# EAGLE schematic KON-SU260 (EAGLE 6.5.0)
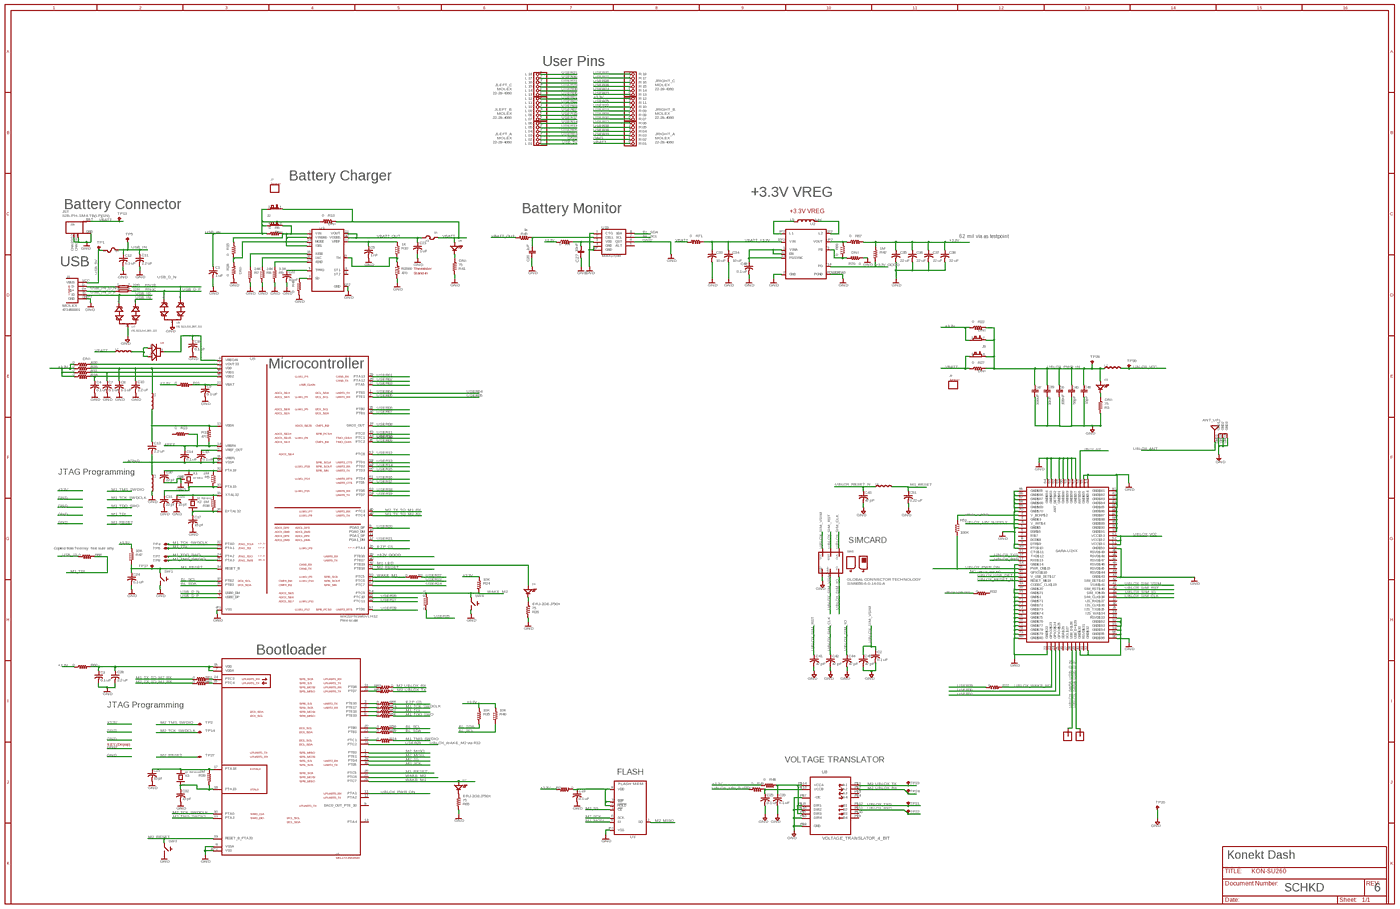
[diagram p0: schematic, sheet 1, overview]
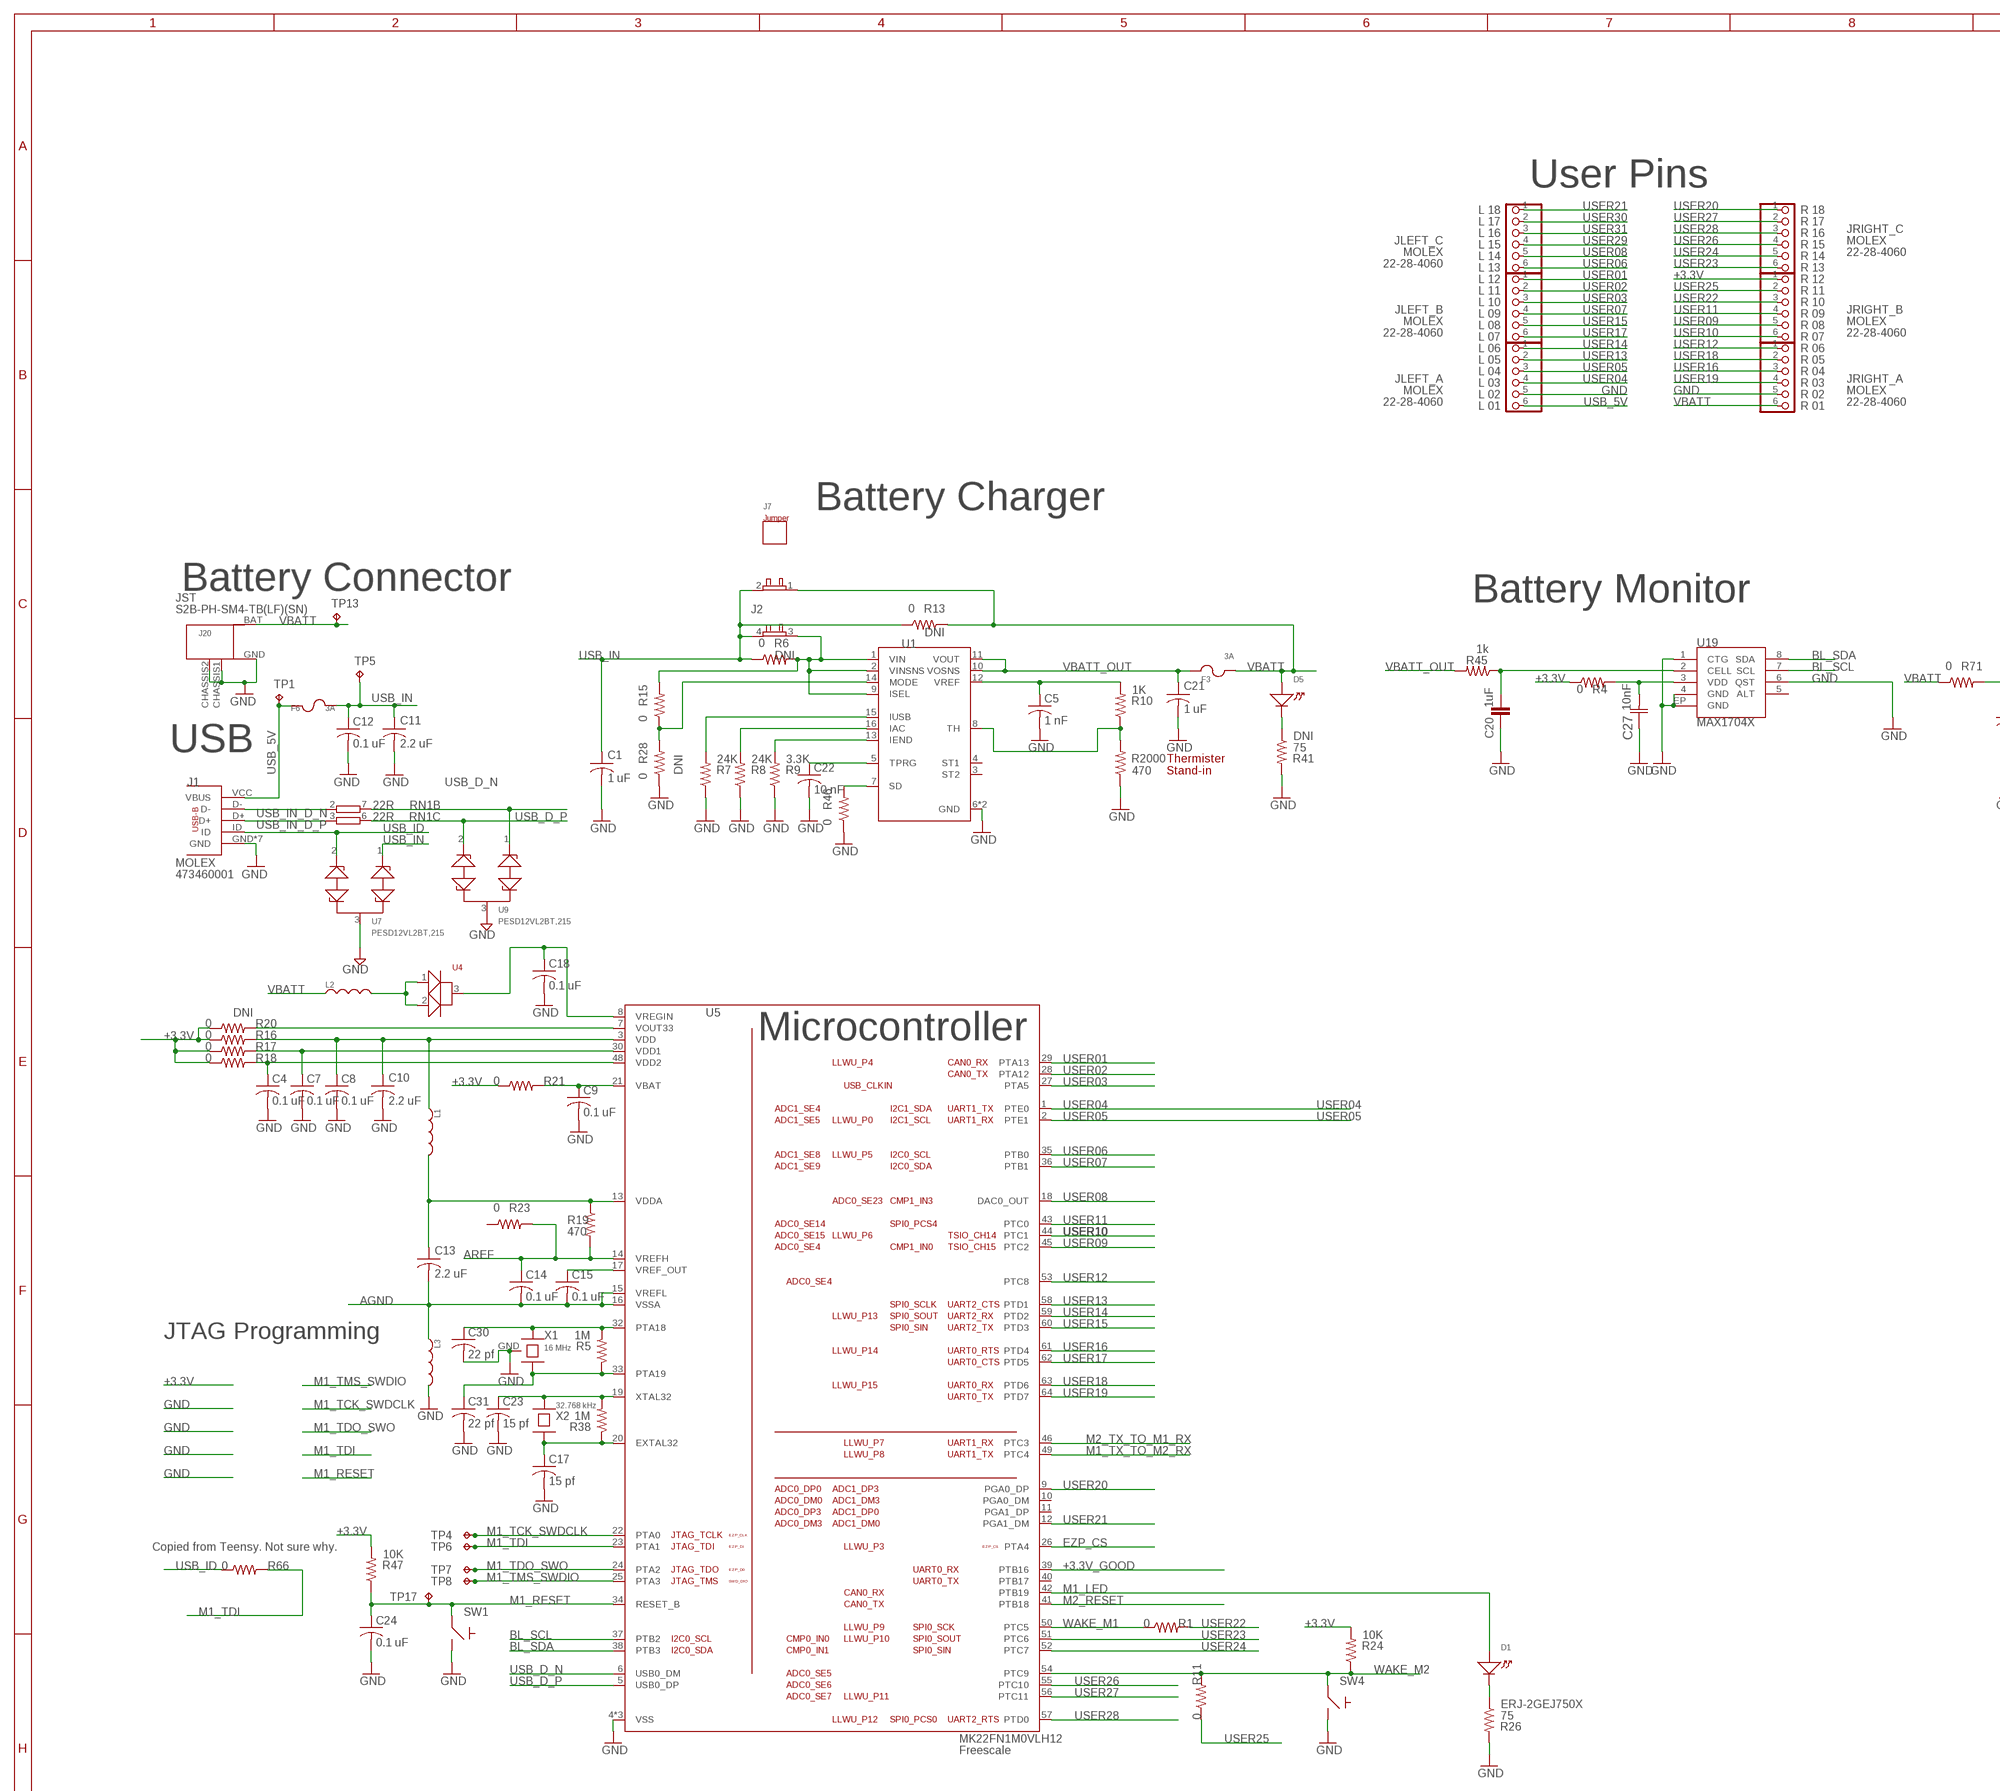
[diagram p1: schematic, sheet 1, part 1 of 4]
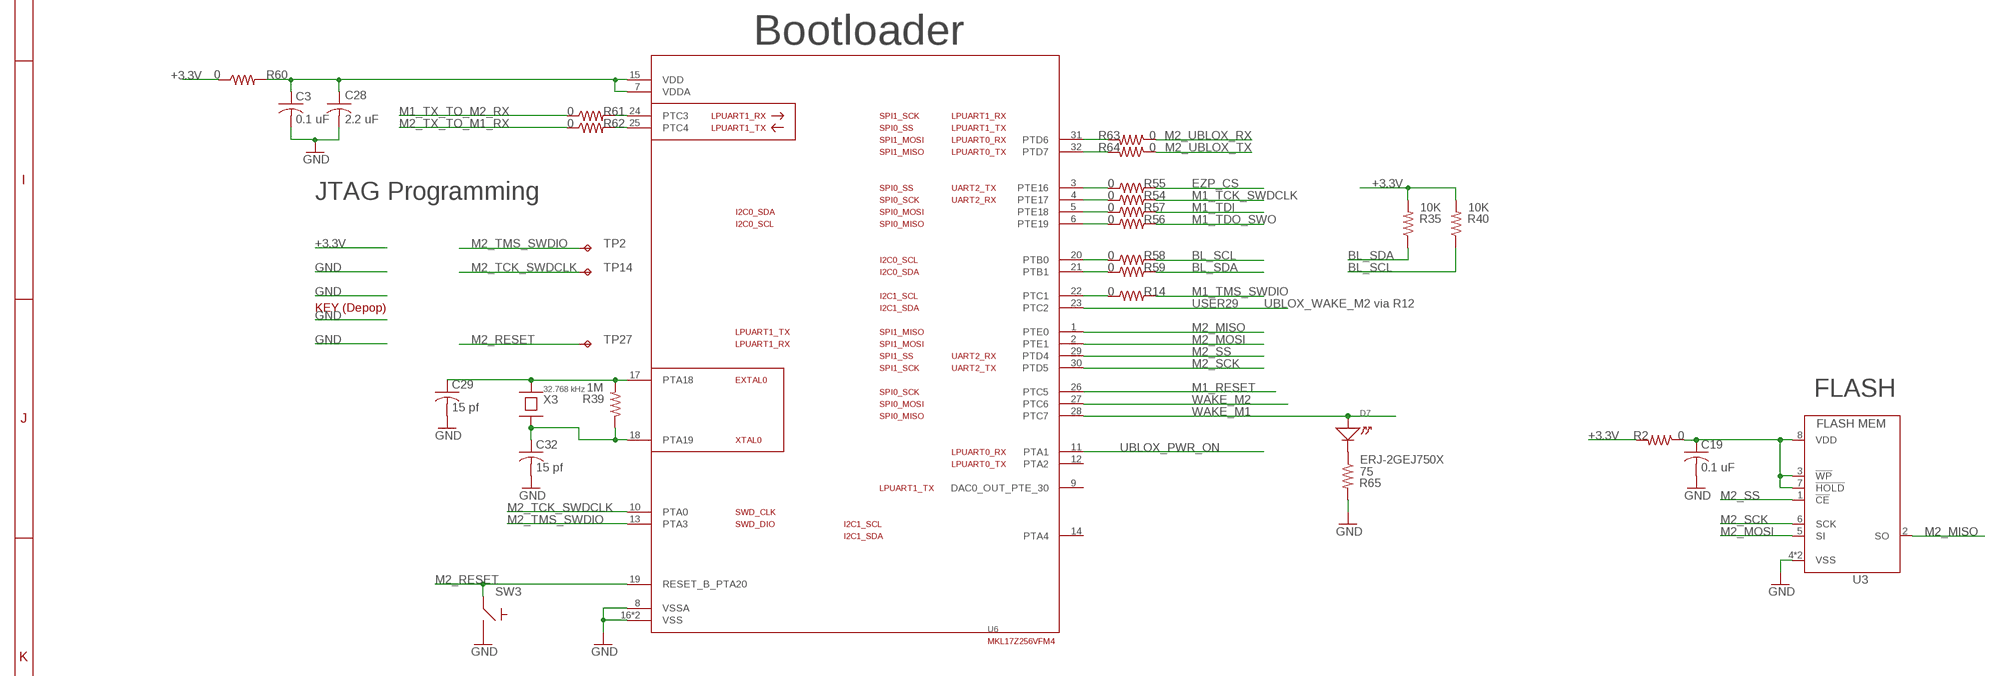
[diagram p2: schematic, sheet 1, part 2 of 4]
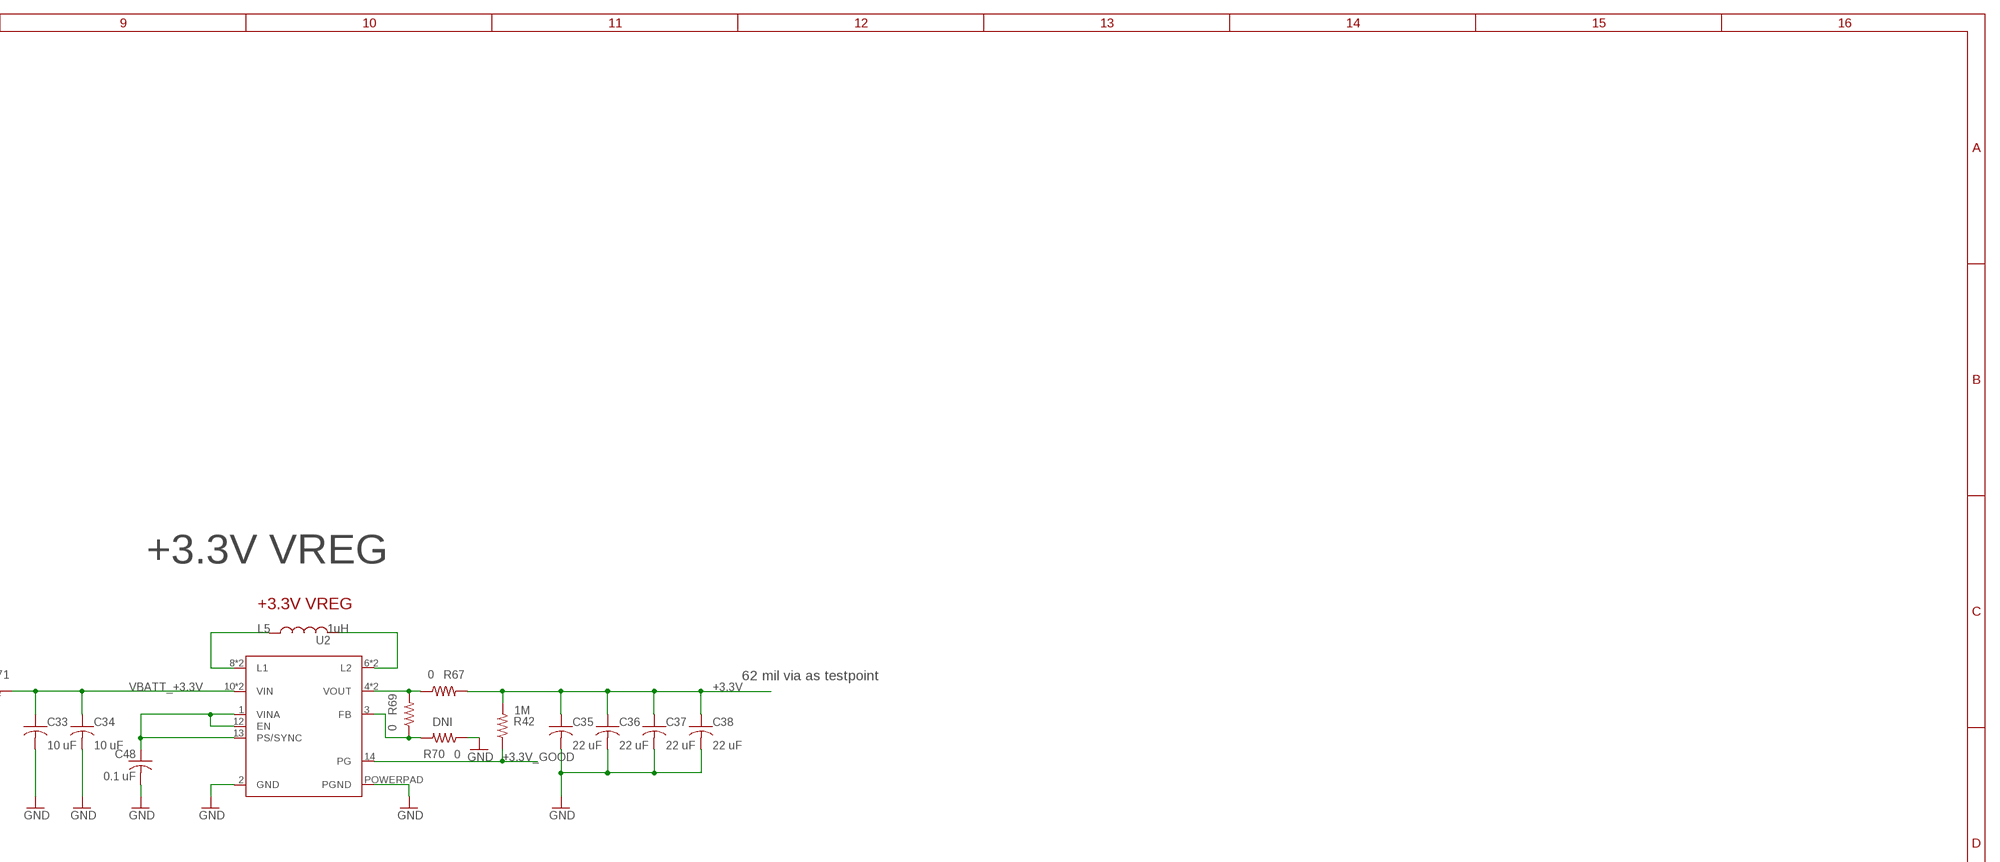
[diagram p3: schematic, sheet 1, part 3 of 4]
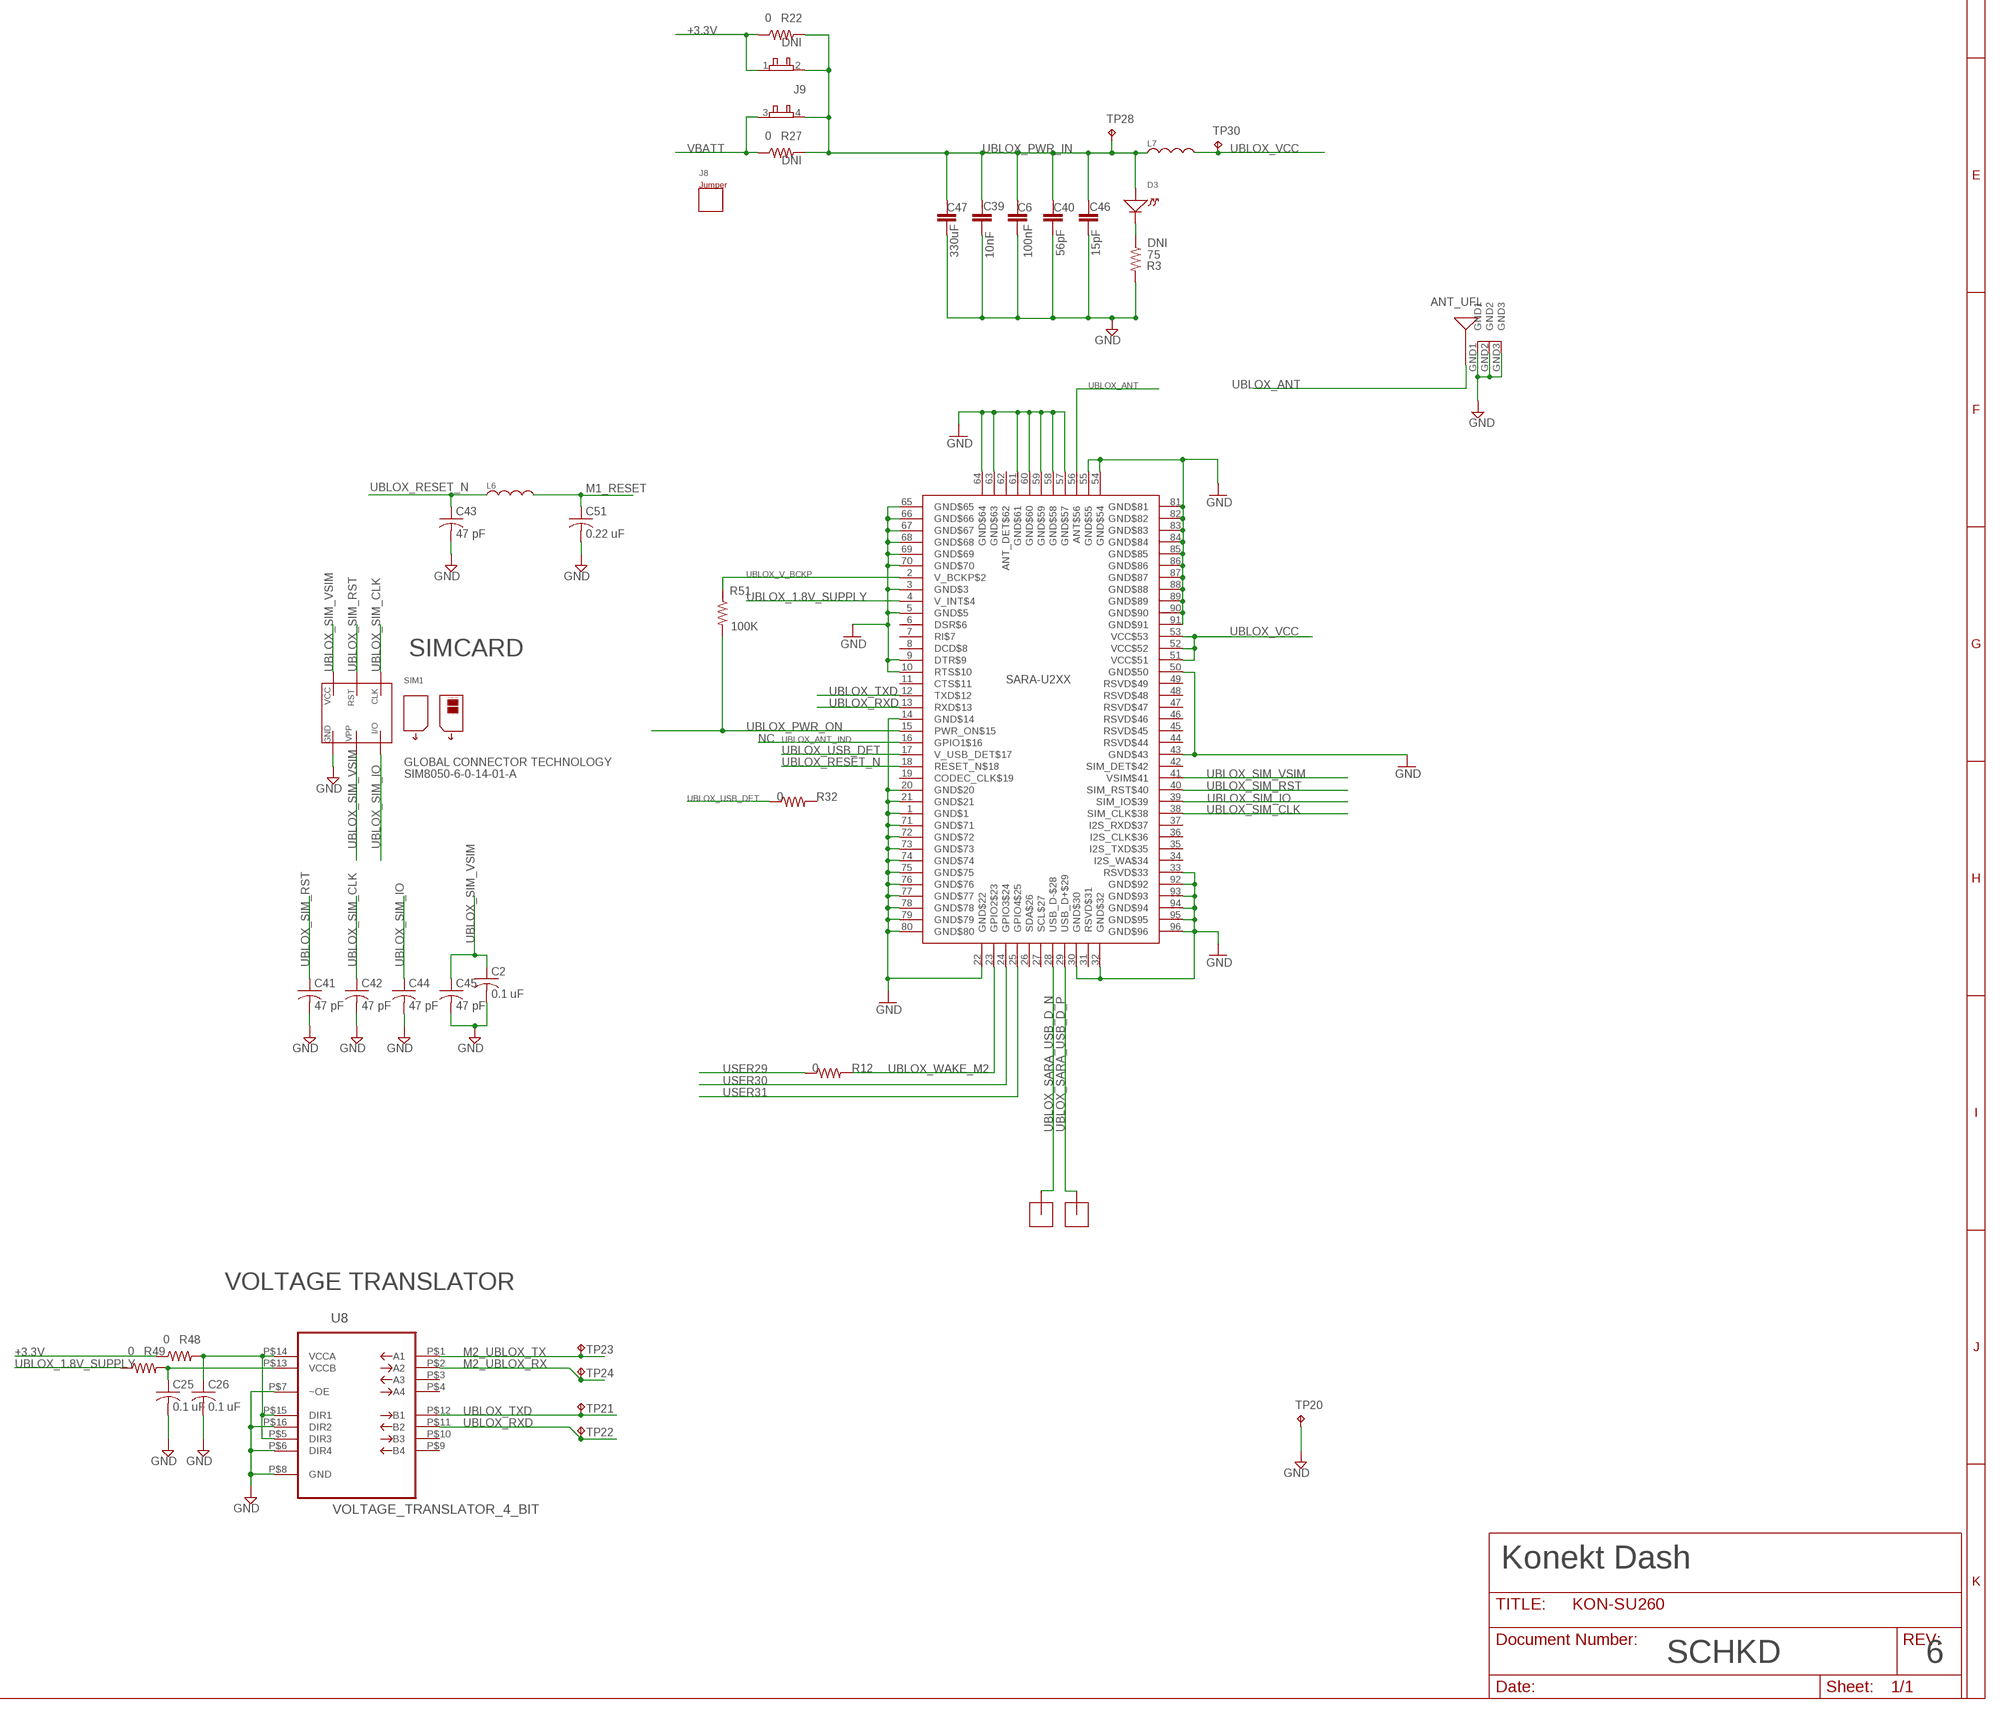
[diagram p4: schematic, sheet 1, part 4 of 4]

## Parts
ANT_UFL  ANT-A-1JB  [UFL]
C1  1 uF  C-USC0603  [C0603]
C2  0.1 uF  C-USC0402  [C0402]
C3  0.1 uF  C-USC0402  [C0402]
C4  0.1 uF  C-USC0402  [C0402]
C5  1 nF  C-USC0402  [C0402]
C6  100nF  CAP0402-CAP  [0402-CAP@1]
C7  0.1 uF  C-USC0402  [C0402]
C8  0.1 uF  C-USC0402  [C0402]
C9  0.1 uF  C-USC0402  [C0402]
C10  2.2 uF  C-USC0603  [C0603]
C11  2.2 uF  C-USC0603  [C0603]
C12  0.1 uF  C-USC0603  [C0603]
C13  2.2 uF  C-USC0603  [C0603]
C14  0.1 uF  C-USC0402  [C0402]
C15  0.1 uF  C-USC0402  [C0402]
C17  15 pf  C-USC0402  [C0402]
C18  0.1 uF  C-USC0402  [C0402]
C19  0.1 uF  C-USC0402  [C0402]
C20  1uF  CAPACITOR0402  [0402-CAP]
C21  1 uF  C-USC0603  [C0603]
C22  10 nF  C-USC0402  [C0402]
C23  15 pf  C-USC0402  [C0402]
C24  0.1 uF  C-USC0402  [C0402]
C25  0.1 uF  C-USC0402  [C0402]
C26  0.1 uF  C-USC0402  [C0402]
C27  10nF  GRM155R71E103KA01D  [CAPC1005X60N]
C28  2.2 uF  C-USC0603  [C0603]
C29  15 pf  C-USC0402  [C0402]
C30  22 pf  C-USC0402  [C0402]
C31  22 pf  C-USC0402  [C0402]
C32  15 pf  C-USC0402  [C0402]
C33  10 uF  C-USC0603  [C0603]
C34  10 uF  C-USC0603  [C0603]
C35  22 uF  C-USC0603  [C0603]
C36  22 uF  C-USC0603  [C0603]
C37  22 uF  C-USC0603  [C0603]
C38  22 uF  C-USC0603  [C0603]
C39  10nF  CAP0402-CAP  [0402-CAP@1]
C40  56pF  CAP0402-CAP  [0402-CAP@1]
C41  47 pF  C-USC0402  [C0402]
C42  47 pF  C-USC0402  [C0402]
C43  47 pF  C-USC0402  [C0402]
C44  47 pF  C-USC0402  [C0402]
C45  47 pF  C-USC0402  [C0402]
C46  15pF  CAP0402-CAP  [0402-CAP@1]
C47  330uF  CAP1210-CAP  [1210-CAP]
C48  0.1 uF  C-USC0402  [C0402]
C51  0.22 uF  C-USC0402  [C0402]
D1  LED_0402_VLMW  [LED_0402_VISHAY_VLMW]
D3  LED_0402_VLMW  [LED_0402_VISHAY_VLMW]
D5  LED_0402_VLMW  [LED_0402_VISHAY_VLMW]
D7  LED_0402_VLMW  [LED_0402_VISHAY_VLMW]
F3  3A  FUSE_0603  [R0603]
F6  3A  FUSE_0603  [R0603]
J1  USB_MICRO_B_MOLEX_473460001  [USB_MICRO_MOLEX_473460001]
J2  CON_JUMPER_1.27_2X2  [FCI_CON_1.27_2X2]
J7  JUMPER_1.27MM  [NOTHING]
J8  JUMPER_1.27MM  [NOTHING]
J9  CON_JUMPER_1.27_2X2  [FCI_CON_1.27_2X2]
J20  BAT_TERM  [JST-PH-2]
JLEFT_A  PINHD-1X6  [1X06]
JLEFT_B  PINHD-1X6  [1X06]
JLEFT_C  PINHD-1X6  [1X06]
JRIGHT_A  PINHD-1X6  [1X06]
JRIGHT_B  PINHD-1X6  [1X06]
JRIGHT_C  PINHD-1X6  [1X06]
L1  INDUCTOR_0603  [R0603$1]
L2  INDUCTOR_0603  [R0603$1]
L3  INDUCTOR_0603  [R0603$1]
L5  1uH  INDUCTOR_1UH_XFL4020-102MEC  [COILCRAFT_XFL4020]
L6  INDUCTOR_0603  [R0603$1]
L7  INDUCTOR_0603  [R0603$1]
R1  0  RESISTOR0402-RES  [0402-RES]
R2  0  RESISTOR0402-RES  [0402-RES]
R3  75  RESISTOR0402-RES  [0402-RES]
R4  0  RESISTOR0402-RES  [0402-RES]
R5  1M  RESISTOR0402-RES  [0402-RES]
R6  0  RESISTOR0402-RES  [0402-RES]
R7  24K  RESISTOR0402-RES  [0402-RES]
R8  24K  RESISTOR0402-RES  [0402-RES]
R9  3.3K  RESISTOR0402-RES  [0402-RES]
R10  1K  RESISTOR0402-RES  [0402-RES]
R11  0  RESISTOR0402-RES  [0402-RES]
R12  0  RESISTOR0402-RES  [0402-RES]
R13  0  RESISTOR0402-RES  [0402-RES]
R14  0  RESISTOR0402-RES  [0402-RES]
R15  0  RESISTOR0402-RES  [0402-RES]
R16  0  RESISTOR0402-RES  [0402-RES]
R17  0  RESISTOR0402-RES  [0402-RES]
R18  0  RESISTOR0402-RES  [0402-RES]
R19  470  R-US_R0402  [R0402]
R20  0  RESISTOR0402-RES  [0402-RES]
R21  0  RESISTOR0402-RES  [0402-RES]
R22  0  RESISTOR0402-RES  [0402-RES]
R23  0  RESISTOR0402-RES  [0402-RES]
R24  10K  RESISTOR0402-RES  [0402-RES]
R26  75  RESISTOR0402-RES  [0402-RES]
R27  0  RESISTOR0402-RES  [0402-RES]
R28  0  RESISTOR0402-RES  [0402-RES]
R32  0  RESISTOR0402-RES  [0402-RES]
R35  10K  RESISTOR0402-RES  [0402-RES]
R38  1M  RESISTOR0402-RES  [0402-RES]
R39  1M  RESISTOR0402-RES  [0402-RES]
R40  10K  RESISTOR0402-RES  [0402-RES]
R41  75  RESISTOR0402-RES  [0402-RES]
R42  1M  RESISTOR0402-RES  [0402-RES]
R45  1k  RESISTOR  [0402-RES]
R46  0  RESISTOR0402-RES  [0402-RES]
R47  10K  RESISTOR0402-RES  [0402-RES]
R48  0  RESISTOR0402-RES  [0402-RES]
R49  0  RESISTOR0402-RES  [0402-RES]
R51  100K  R-US_R0402  [R0402]
R54  0  RESISTOR0402-RES  [0402-RES]
R55  0  RESISTOR0402-RES  [0402-RES]
R56  0  RESISTOR0402-RES  [0402-RES]
R57  0  RESISTOR0402-RES  [0402-RES]
R58  0  RESISTOR0402-RES  [0402-RES]
R59  0  RESISTOR0402-RES  [0402-RES]
R60  0  RESISTOR0402-RES  [0402-RES]
R61  0  RESISTOR0402-RES  [0402-RES]
R62  0  RESISTOR0402-RES  [0402-RES]
R63  0  RESISTOR0402-RES  [0402-RES]
R64  0  RESISTOR0402-RES  [0402-RES]
R65  75  RESISTOR0402-RES  [0402-RES]
R66  0  RESISTOR0402-RES  [0402-RES]
R67  0  RESISTOR0402-RES  [0402-RES]
R69  0  RESISTOR0402-RES  [0402-RES]
R70  0  RESISTOR0402-RES  [0402-RES]
R71  0  RESISTOR0402-RES  [0402-RES]
R2000  470  RESISTOR0402-RES  [0402-RES]
RN1  22R  4R-NCAY16  [CAY16]
SIM1  SIM_CARD_NANO  [SIM_CARD_NANO]
SW1  SWITCH_PANASONIC_EVP-BB2A1B000  [SWITCH_PANASONIC_EVPBB]
SW3  SWITCH_PANASONIC_EVP-BB2A1B000  [SWITCH_PANASONIC_EVPBB]
SW4  SWITCH_PANASONIC_EVP-BB2A1B000  [SWITCH_PANASONIC_EVPBB]
TP1  TPTP08R  [TP08R]
TP2  TPTP08R  [TP08R]
TP4  TPTP08R  [TP08R]
TP5  TPTP08R  [TP08R]
TP6  TPTP08R  [TP08R]
TP7  TPTP08R  [TP08R]
TP8  TPTP08R  [TP08R]
TP13  TPTP08R  [TP08R]
TP14  TPTP08R  [TP08R]
TP17  TPTP08R  [TP08R]
TP20  TPTP08R  [TP08R]
TP21  TPTP08R  [TP08R]
TP22  TPTP08R  [TP08R]
TP23  TPTP08R  [TP08R]
TP24  TPTP08R  [TP08R]
TP27  TPTP08R  [TP08R]
TP28  TPTP08R  [TP08R]
TP30  TPTP08R  [TP08R]
U1  ST_MICRO_BAT_CHARGER_L6924U013  [BAT_CHARGE_ST_MICRO_L6924U]
U2  TPS63021  [QFN-14-POWERPAD3X4DSJ]
U3  MICROCHIP_FLASH_MEM  [TDFN8_5X6]
U4  DIODE_DUAL_SCHOTKEY  [SOT23-3]
U5  MK20DX128VLH5  [MK20DX128VLH5]
U6  FREESCALE_MKL17Z256VFM4  [QFN_32_5X5]
U7  PESD12VL2BT,215  [SOT23]
U8  VOLTAGE_TRANSLATOR_4_BIT  [UQFN_16]
U9  PESD12VL2BT,215  [SOT23]
U19  MAX1704X  [TDFN-8]
U420  SARA-U2XX  [91-PIN_LGA]
U$1  TESTPAD  [TESTPAD]
U$2  TESTPAD  [TESTPAD]
X1  16 MHz  CERAMIC_RESONATOR_16MHZ_MURATA_CSTCE  [CRYSTAL_RESONATOR_MURATA_CSTCE]
X2  32.768 kHz  CRYSTAL_32.768K_AVX  [CRYSTAL_ST3215SB]
X3  32.768 kHz  CRYSTAL_32.768K_AVX  [CRYSTAL_ST3215SB]

## Nets
+3.3V: C35.1 C36.1 C37.1 C38.1 J9.1 JRIGHT_B.1 R2.2 R4.1 R16.1 R17.1 R18.1 R20.1 R21.1 R22.1 R24.2 R35.2 R40.2 R42.2 R47.2 R48.1 R60.1 R67.2
+3.3V_FLASH: C19.1 R2.1 U3.3(!WP) U3.7(!HOLD) U3.8(VDD)
+3.3V_GOOD: R42.1 U2.14(PG) U5.39(PTB16)
AGND: C13.2 C14.2 C15.2 L3.1 U5.15(VREFL) U5.16(VSSA)
AREF: C14.1 R19.2 R23.2 U5.14(VREFH)
BL_SCL [HIGH_SPEED]: R40.1 R58.2 U5.37(PTB2) U19.7(SCL)
BL_SDA [HIGH_SPEED]: R35.1 R59.2 U5.38(PTB3) U19.8(SDA)
EZP_CS: R55.2 U5.26(PTA4)
GND [gnd]: ANT_UFL.GND1 ANT_UFL.GND2 ANT_UFL.GND3 C1.2 C2.2 C3.2 C4.2 C5.2 C6.1 C7.2 C8.2 C9.2 C10.2 C11.2 C12.2 C17.2 C18.2 C19.2 C20.2 C21.2 C22.2 C23.2 C24.2 C25.2 C26.2 C27.1(C1) C28.2 C29.2 C30.2 C31.2 C32.2 C33.2 C34.2 C35.2 C36.2 C37.2 C38.2 C39.1 C40.1 C41.2 C42.2 C43.2 C44.2 C45.2 C46.1 C47.2 C48.2 C51.2 J1.GND J1.GND$1(GND) J1.GND$2(GND) J1.GND$3(GND) J1.GND$4(GND) J1.GND$5(GND) J1.GND$6(GND) J20.CHASSIS1(CHASSIS_1) J20.CHASSIS2(CHASSIS_2) J20.GND JLEFT_A.5 JRIGHT_A.5 L3.2 R3.2 R7.1 R8.1 R9.1 R26.2 R28.1 R41.2 R46.1 R65.2 R70.1 R2000.1 SIM1.C5(GND) SW1.B SW1.B2 SW3.B SW3.B2 SW4.B SW4.B2 TP20.TP U1.6(GND) U1.PAD(GND) U2.2(GND) U2.POWERPAD(PGND) U3.4(VSS) U3.P$9(VSS) U5.4(VSS) U5.31(VSS) U5.47(VSS) U6.8(VSSA) U6.16(VSS) U6.PAD(VSS) U7.3 U8.P$6(DIR4) U8.P$7(~OE) U8.P$8(GND) U8.P$16(DIR2) U9.3 U19.1(CTG) U19.4(GND) U19.6(QST) U19.EP(GND) U420.1(GND$1) U420.3(GND$3) U420.5(GND$5) U420.9(DTR$9) U420.10(RTS$10) U420.14(GND$14) U420.20(GND$20) U420.21(GND$21) U420.22(GND$22) U420.30(GND$30) U420.32(GND$32) U420.33(RSVD$33) U420.43(GND$43) U420.50(GND$50) U420.54(GND$54) U420.55(GND$55) U420.57(GND$57) U420.58(GND$58) U420.59(GND$59) U420.60(GND$60) U420.61(GND$61) U420.63(GND$63) U420.64(GND$64) U420.65(GND$65) U420.66(GND$66) U420.67(GND$67) U420.68(GND$68) U420.69(GND$69) U420.70(GND$70) U420.71(GND$71) U420.72(GND$72) U420.73(GND$73) U420.74(GND$74) U420.75(GND$75) U420.76(GND$76) U420.77(GND$77) U420.78(GND$78) U420.79(GND$79) U420.80(GND$80) U420.81(GND$81) U420.82(GND$82) U420.83(GND$83) U420.84(GND$84) U420.85(GND$85) U420.86(GND$86) U420.87(GND$87) U420.88(GND$88) U420.89(GND$89) U420.90(GND$90) U420.91(GND$91) U420.92(GND$92) U420.93(GND$93) U420.94(GND$94) U420.95(GND$95) U420.96(GND$96) X1.GND
M1_LED: D1.ANODE U5.42(PTB19)
M1_RESET: C24.1 C51.1 L6.2 R47.1 SW1.A SW1.A2 TP17.TP U5.34(RESET_B) U6.26(PTC5)
M1_TCK_SWDCLK: R54.2 TP4.TP U5.22(PTA0)
M1_TDI: R57.2 R66.2 TP6.TP U5.23(PTA1)
M1_TDO_SWO: R56.2 TP7.TP U5.24(PTA2)
M1_TMS_SWDIO: R14.2 TP8.TP U5.25(PTA3)
M1_TX_TO_M2_RX: R61.1 U5.49(PTC4)
M2_MISO: U3.2(SO) U6.1(PTE0)
M2_MOSI: U3.5(SI) U6.2(PTE1)
M2_RESET: SW3.A SW3.A2 TP27.TP U5.41(PTB18) U6.19(RESET_B_PTA20)
M2_RX: R61.2 U6.24(PTC3)
M2_SCK: U3.6(SCK) U6.30(PTD5)
M2_SPI0_MISO: R56.1 U6.6(PTE19)
M2_SPI0_MOSI: R57.1 U6.5(PTE18)
M2_SS: U3.1(!CE) U6.29(PTD4)
M2_TCK_SWDCLK: TP14.TP U6.10(PTA0)
M2_TMS_SWDIO: TP2.TP U6.13(PTA3)
M2_TX: R62.2 U6.25(PTC4)
M2_TX_TO_M1_RX: R62.1 U5.46(PTC3)
M2_UBLOX_RX: R63.1 TP24.TP U8.P$2(A2)
M2_UBLOX_TX: R64.1 TP23.TP U8.P$1(A1)
N$1: C20.1 R45.1 U19.2(CELL)
N$3: C27.2(C2) R4.2 U19.3(VDD)
N$4: J2.3 R6.2 R15.2 U1.1(VIN) U1.2(VINSNS) U1.9(ISEL)
N$5: R10.1 R2000.2 U1.8(TH)
N$6: C5.1 R10.2 U1.12(VREF)
N$7: D3.CATHODE R3.1
N$8: R7.2 U1.15(IUSB)
N$9: L5.P$1 U2.8(L1) U2.9(L1)
N$10: R8.2 U1.16(IAC)
N$11: C30.1 R5.2 U5.32(PTA18) X1.XTAL1
N$12: R9.2 U1.13(IEND)
N$13: D5.CATHODE R41.1
N$14: C22.1 U1.5(TPRG)
N$17: C8.1 C10.1 L1.1 R16.2 U5.3(VDD)
N$18: C7.1 R17.2 U5.30(VDD1)
N$19: C4.1 R18.2 U5.48(VDD2)
N$20: C18.1 U4.3(C) U5.8(VREGIN)
N$21: R20.2 U5.7(VOUT33)
N$22: C15.1 U5.17(VREF_OUT)
N$23: C13.1 L1.2 R19.1 U5.13(VDDA)
N$25: L2.2 U4.1(A1) U4.2(A2)
N$27: C9.1 R21.2 U5.21(VBAT)
N$28: C31.1 R5.1 U5.33(PTA19) X1.XTAL2
N$29: C23.1 R38.2 U5.19(XTAL32) X2.P$2(XTAL2)
N$30: R58.1 U6.20(PTB0)
N$31: C17.1 R38.1 U5.20(EXTAL32) X2.P$1(XTAL1)
N$32: L5.P$2 U2.6(L2) U2.7(L2)
N$33: D1.CATHODE R26.1
N$35: R14.1 U6.22(PTC1)
N$36: R15.1 R28.2 U1.14(MODE)
N$37: R46.2 U1.7(SD)
N$38: R67.1 R69.2 U2.4(VOUT) U2.5(VOUT)
N$40: R63.2 U6.31(PTD6)
N$41: R64.2 U6.32(PTD7)
N$42: R55.1 U6.3(PTE16)
N$43: R54.1 U6.4(PTE17)
N$48: R59.1 U6.21(PTB1)
N$51: C3.1 C28.1 R60.2 U6.7(VDDA) U6.15(VDD)
N$56: D7.CATHODE R65.1
N$57: C32.1 R39.1 U6.18(PTA19) X3.P$1(XTAL1)
N$58: C29.1 R39.2 U6.17(PTA18) X3.P$2(XTAL2)
N$59: C48.1 U2.1(VINA) U2.12(EN) U2.13(PS/SYNC)
N$61: R69.1 R70.2 U2.3(FB)
UBLOX_1.8V_SUPPLY: R49.1 U420.4(V_INT$4)
UBLOX_ANT [HIGH_SPEED]: ANT_UFL.SIGNAL U420.56(ANT$56)
UBLOX_ANT_IND: U420.16(GPIO1$16)
UBLOX_PWR_IN: C6.2 C39.2 C40.2 C46.2 C47.1 D3.ANODE J9.2 J9.4 L7.1 R22.2 R27.2 TP28.TP
UBLOX_PWR_ON: R51.2 U6.11(PTA1) U420.15(PWR_ON$15)
UBLOX_RESET_N: C43.1 L6.1 U420.18(RESET_N$18)
UBLOX_RXD [HIGH_SPEED]: TP22.TP U8.P$11(B2) U420.13(RXD$13)
UBLOX_SARA_USB_D_N [DIFF_HIGH_SPEED]: U420.28(USB_D-$28) U$2.P$1
UBLOX_SARA_USB_D_P [DIFF_HIGH_SPEED]: U420.29(USB_D+$29) U$1.P$1
UBLOX_SIM_CLK [HIGH_SPEED]: C42.1 SIM1.C3(CLK) U420.38(SIM_CLK$38)
UBLOX_SIM_IO [HIGH_SPEED]: C44.1 SIM1.C7(IO) U420.39(SIM_IO$39)
UBLOX_SIM_RST [HIGH_SPEED]: C41.1 SIM1.C2(RST) U420.40(SIM_RST$40)
UBLOX_SIM_VSIM [HIGH_SPEED]: C2.1 C45.1 SIM1.C1(VCC) SIM1.C6(VCC2) U420.41(VSIM$41)
UBLOX_TXD [HIGH_SPEED]: TP21.TP U8.P$12(B1) U420.12(TXD$12)
UBLOX_USB_DET [Vbatt]: R32.1 U420.17(V_USB_DET$17)
UBLOX_V_BCKP: R51.1 U420.2(V_BCKP$2)
UBLOX_VCC: L7.2 TP30.TP U420.51(VCC$51) U420.52(VCC$52) U420.53(VCC$53)
UBLOX_WAKE_M2: R12.2 U420.23(GPIO2$23)
USB_5V: F6.1 J1.VCC(VBUS) JLEFT_A.6 TP1.TP
USB_D_N [DIFF_HIGH_SPEED]: RN1.7 U5.6(USB0_DM) U9.1
USB_D_P [DIFF_HIGH_SPEED]: RN1.6 U5.5(USB0_DP) U9.2
USB_ID: J1.ID R66.1 U7.2
USB_IN [Vbatt]: C1.1 C11.1 C12.1 F6.2 J2.2 J2.4 R6.1 R13.1 TP5.TP U7.1
USB_IN_D_N [DIFF_HIGH_SPEED]: J1.D- RN1.2
USB_IN_D_P [DIFF_HIGH_SPEED]: J1.D+ RN1.3
USER01 [HIGH_SPEED]: JLEFT_B.1 U5.29(PTA13)
USER02 [HIGH_SPEED]: JLEFT_B.2 U5.28(PTA12)
USER03 [HIGH_SPEED]: JLEFT_B.3 U5.27(PTA5)
USER04 [HIGH_SPEED]: JLEFT_A.4 U5.1(PTE0)
USER05 [HIGH_SPEED]: JLEFT_A.3 U5.2(PTE1)
USER06 [HIGH_SPEED]: JLEFT_C.6 U5.35(PTB0)
USER07 [HIGH_SPEED]: JLEFT_B.4 U5.36(PTB1)
USER08 [HIGH_SPEED]: JLEFT_C.5 U5.18(DAC0_OUT)
USER09 [HIGH_SPEED]: JRIGHT_B.5 U5.45(PTC2)
USER10 [HIGH_SPEED]: JRIGHT_B.6 U5.44(PTC1)
USER11 [HIGH_SPEED]: JRIGHT_B.4 U5.43(PTC0)
USER12 [HIGH_SPEED]: JRIGHT_A.1 U5.53(PTC8)
USER13 [HIGH_SPEED]: JLEFT_A.2 U5.58(PTD1)
USER14 [HIGH_SPEED]: JLEFT_A.1 U5.59(PTD2)
USER15 [HIGH_SPEED]: JLEFT_B.5 U5.60(PTD3)
USER16 [HIGH_SPEED]: JRIGHT_A.3 U5.61(PTD4)
USER17 [HIGH_SPEED]: JLEFT_B.6 U5.62(PTD5)
USER18 [HIGH_SPEED]: JRIGHT_A.2 U5.63(PTD6)
USER19 [HIGH_SPEED]: JRIGHT_A.4 U5.64(PTD7)
USER20: JRIGHT_C.1 U5.9(PGA0_DP)
USER21: JLEFT_C.1 U5.12(PGA1_DM)
USER22 [HIGH_SPEED]: JRIGHT_B.3 R1.2
USER23 [HIGH_SPEED]: JRIGHT_C.6 U5.51(PTC6)
USER24: JRIGHT_C.5 U5.52(PTC7)
USER25: JRIGHT_B.2 R11.1
USER26: JRIGHT_C.4 U5.55(PTC10)
USER27: JRIGHT_C.2 U5.56(PTC11)
USER28 [HIGH_SPEED]: JRIGHT_C.3 U5.57(PTD0)
USER29 [HIGH_SPEED]: JLEFT_C.4 R12.1 U6.23(PTC2)
USER30 [HIGH_SPEED]: JLEFT_C.2 U420.24(GPIO3$24)
USER31 [HIGH_SPEED]: JLEFT_C.3 U420.25(GPIO4$25)
VBATT: D5.ANODE F3.1 J2.1 J9.3 J20.BAT JRIGHT_A.6 L2.1 R13.2 R27.1 R71.1 TP13.TP
VBATT_+3.3V [power]: C33.1 C34.1 R71.2 U2.10(VIN) U2.11(VIN)
VBATT_OUT: C21.1 F3.2 R45.2 U1.10(VOSNS) U1.11(VOUT)
VTL_+3.3V1: C26.1 R48.2 U8.P$5(DIR3) U8.P$14(VCCA) U8.P$15(DIR1)
VTL_LISA_VCC1: C25.1 R49.2 U8.P$13(VCCB)
WAKE_M1: D7.ANODE R1.1 U5.50(PTC5) U6.28(PTC7)
WAKE_M2: R11.2 R24.1 SW4.A SW4.A2 U5.54(PTC9) U6.27(PTC6)
Unconnected: R23.1 R32.2 RN1.1 RN1.4 RN1.5 RN1.8 SIM1.MTG1(NC1) SIM1.MTG2(NC2) U1.3(ST2) U1.4(ST1) U5.10(PGA0_DM) U5.11(PGA1_DP) U5.40(PTB17) U6.9(DAC0_OUT_PTE_30) U6.12(PTA2) U6.14(PTA4) U8.P$3(A3) U8.P$4(A4) U8.P$9(B4) U8.P$10(B3) U19.5(ALT) U420.6(DSR$6) U420.7(RI$7) U420.8(DCD$8) U420.11(CTS$11) U420.19(CODEC_CLK$19) U420.36(I2S_CLK$36) U420.37(I2S_RXD$37) U420.42(SIM_DET$42) U420.44(RSVD$44) U420.45(RSVD$45) U420.46(RSVD$46) U420.47(RSVD$47) U420.48(RSVD$48) U420.49(RSVD$49)

## Notes on the sheet
- User Pins
- L 18 | R 18
- L 17 | R 17
- L 16 | R 16
- L 15 | R 15
- L 14 | R 14
- L 13 | R 13
- L 12 | R 12
- L 11 | R 11
- L 10 | R 10
- L 09 | R 09
- L 08 | R 08
- L 07 | R 07
- L 06 | R 06
- L 05 | R 05
- L 04 | R 04
- L 03 | R 03
- L 02 | R 02
- L 01 | R 01
- Battery Charger
- +3.3V VREG
- Battery Connector
- Battery Monitor | +3.3V VREG
- 62 mil via as testpoint
- USB
- Thermister
  Stand-in
- Microcontroller
- JTAG Programming
- SIMCARD
- EZP_CLK
- Copied from Teensy. Not sure why. | EZP_DI | EZP_CS
- EZP_D0
- SWD_DIO
- NC
- Bootloader
- JTAG Programming
- KEY (Depop) | UBLOX_WAKE_M2 via R12
- VOLTAGE TRANSLATOR
- FLASH
- Konekt Dash
- SCHKD | 6

## Power pins joined to a net without a drawn wire
ANT_DET$62: U420.62(ANT_DET$62)
I2S_TXD$35: U420.35(I2S_TXD$35)
I2S_WA$34: U420.34(I2S_WA$34)
RSVD$31: U420.31(RSVD$31)
SCL$27: U420.27(SCL$27)
SDA$26: U420.26(SDA$26)

## Library data of the parts
ANT_UFL = Konekt2:ANT-A-1JB; MFG: AMPHENOL; MPN: A-1JB; PACKAGE: UFL; PARTNUM: A-1JB
C1 C21 = resistor:C-US: CAPACITOR, American symbol; MFG: MURATA; MPN: GRM188R71C105KA12D; PKG: 0603
C2-C4 C7 C8 C14 C15 C18 C19 C24 C26 C48 = konekt:C-US: CAPACITOR, American symbol; MFG: MURATA; MPN: GRM155R61C104KA88D; PACKAGE: 0402
C5 = resistor:C-US: CAPACITOR, American symbol; MFG: MURATA; MPN: GRM319R71H102KA01D; PKG: 0402
C6 = GeneralLib:CAP: Capacitor; DESCRIPTION: Capacitor, 100nF, 25V, 10%; MANUFACTURER: Murata; MFG: MURATA; MPN: GRM155R71C104KA88D
C9 = konekt:C-US: CAPACITOR, American symbol; MFG: AVX/ELCO; MPN: 0402YC104KAT2A; PACKAGE: 0402
C10 C11 C13 C28 = resistor:C-US: CAPACITOR, American symbol; MFG: SAMSUNG; MPN: CL10A225MQ8NNNC; PKG: 0603
C12 = resistor:C-US: CAPACITOR, American symbol; MFG: AVX; MPN: 0603YC104KAT2A; PARTNUM: 0603YC104KAT2A; PKG: 0603
C17 C23 C29 C32 = konekt:C-US: CAPACITOR, American symbol; MFG: AVX/ELCO; MPN: 04025A150JAT2A; PACKAGE: 0402
C20 = LooseLib1:CAPACITOR; CROSS: YES; DESCRIPTION: Capacitor, 10%, 50V; MFG: AVX; MPN: 04026D105KAT2A; PRODUCTION: YES; TOLERANCE: 10%; VOLTAGE: 50V
C22 = resistor:C-US: CAPACITOR, American symbol; MFG: MURATA; MPN: GRM155R71C103KA01D; PKG: 0402
C25 = konekt:C-US: CAPACITOR, American symbol; MFG: MURATA; MPN: GRM155R61C104KA88D104KAT2A; PACKAGE: 0402
C27 = Caplib1:GRM155R71E103KA01D: CAPACITOR, 0402; CROSS: YES; DESCRIPTION: CAPACITOR, 0402; MFG: Murata; MPN: GRM155R71E103KA01D; OC_FARNELL: 8819734; OC_NEWARK: 37K6460; PRODUCTION: YES; SUPPLIER: Murata; TOLERANCE: ±10%; VOLTAGERATING: 25V
C30 C31 = konekt:C-US: CAPACITOR, American symbol; MFG: AVX/ELCO; MPN: 04025A220JAT2A; PACKAGE: 0402
C33 C34 = resistor:C-US: CAPACITOR, American symbol; MFG: MURATA; MPN: GRM188R60J106ME84D; PKG: 0603
C35-C38 = resistor:C-US: CAPACITOR, American symbol; MFG: MURATA; MPN: GRM188R60J226MEA0D; PKG: 0603
C39 = GeneralLib:CAP: Capacitor; DESCRIPTION: Capacitor, 10nF, 25V, 10%; MANUFACTURER: AVX; MFG: MURATA; MPN: GRM155R71E103KA01D
C40 = GeneralLib:CAP: Capacitor; DESCRIPTION: Capacitor, 56pF, 50V, 5%; MANUFACTURER: Kemet; MFG: KEMET; MPN: C0402C560J5GACTU
C41-C45 = resistor:C-US: CAPACITOR, American symbol; MFG: AVX; MPN: 04025A470JAT2A; PKG: 0402
C46 = GeneralLib:CAP: Capacitor; DESCRIPTION: Capacitor, 15pF, 50V, 5%; MANUFACTURER: Kemet; MFG: KEMET; MPN: C0402C150J5GACTU
C47 = GeneralLib:CAP: Capacitor; DESCRIPTION: Capacitor, 330uF, 6.3V, 20%; MANUFACTURER: AVX; MFG: AVX; MPN: F950J337MBAAQ2
C51 = konekt:C-US: CAPACITOR, American symbol; MFG: MURATA; MPN: GRM155R60J224KE01D; PACKAGE: 0402
D1 D3 D5 D7 = konekt:LED_0402_VLMW; MFG: VISHAY; MPN: VLMW1500-GS08; PACKAGE: 0402
F3 F6 = Konekt2:FUSE_0603; MFG: Bourns; MPN: SF-0603S300-2; PKG: 0603
J1 = konekt:USB_MICRO_B_MOLEX_473460001; MFG: MOLEX; MPN: 473460001; PACKAGE: CUSTOM; PARTNUM: 473460001
J2 J9 = konekt:CON_JUMPER_1.27_2X2; MFG: FCI; MPN: 20021121-00004C4LF; PACKAGE: 1.27_2x2
J7 J8 = konekt:JUMPER_1.27MM; MFG: HARWIN; MPN: M50-1920005; PACKAGE: M50
J20 = Konekt2:BAT_TERM; HEIGHT: 4.8; LENGTH: 9.6; MFG: JST; MPN: S2B-PH-SM4-TB(LF)(SN); PACKAGE: JST-2; PARTNUM: S2B-PH-SM4-TB(LF)(SN); WIDTH: 5.8
JLEFT_A JLEFT_B JLEFT_C JRIGHT_A JRIGHT_B JRIGHT_C = pinhead:PINHD-1X6: PIN HEADER; MFG: MOLEX; MPN: 22-28-4060; PACKAGE: CUSTOM
L1 L3 = Konekt2:INDUCTOR_0603; MFG: Murata; MPN: BLM18AG121SN1D; PKG: 0603
L2 L6 = Konekt2:INDUCTOR_0603; MFG: TDK; MPN: MPZ1608S221A; PKG: 0603
L5 = konekt:INDUCTOR_1UH_XFL4020-102MEC; MFG: COILCRAFT; MPN: XFL4020-102MEC; PACKAG: XFL4020
L7 = Konekt2:INDUCTOR_0603; MFG: MURATA; MPN: BLM18EG221SN1D; PKG: 0603
R1 R2 R4 R11 R12 R14-R18 R21 R23 R32 R46 R48 R49 R54-R64 R66 R67 R69 R71 = GeneralLib:RESISTOR: Resistor; DESCRIPTION: Resistor, 1%, 0.125W; MANUFACTURER: Panasonic; MFG: PANASONIC; MPN: ERJ-2GE0R00X
R3 R41 = GeneralLib:RESISTOR: Resistor; DESCRIPTION: Resistor, 1%, 0.125W; MANUFACTURER: Panasonic; MFG: PANASONIC; MPN: DNI; MPN_DNI: ERJ-2GEJ750X
R5 R38 R39 R42 = GeneralLib:RESISTOR: Resistor; DESCRIPTION: Resistor, 1%, 0.125W; MANUFACTURER: Yaego; MFG: YAEGO; MPN: RC0402JR-071ML
R6 R13 R20 R22 R27 R28 = GeneralLib:RESISTOR: Resistor; DESCRIPTION: Resistor, 1%, 0.125W; MANUFACTURER: Panasonic; MFG: PANASONIC; MPN: DNI; MPN_DNI: ERJ-2GE0R00X
R7 R8 = GeneralLib:RESISTOR: Resistor; DESCRIPTION: Resistor, 1%, 0.125W; MANUFACTURER: Yaego; MFG: YAEGO; MPN: RC0402JR-0724KL
R9 = GeneralLib:RESISTOR: Resistor; DESCRIPTION: Resistor, 1%, 0.125W; MANUFACTURER: Yaego; MFG: YAEGO; MPN: RC0402JR-073K3L
R10 = GeneralLib:RESISTOR: Resistor; DESCRIPTION: Resistor, 1%, 0.125W; MANUFACTURER: Yaego; MFG: YAEGO; MPN: RC0402JR-071KL
R19 = resistor:R-US_: RESISTOR, American symbol; MFG: Panasonic; MPN: ERJ-2GEJ471X; PKG: 0402
R24 R35 R40 R47 = GeneralLib:RESISTOR: Resistor; DESCRIPTION: Resistor, 1%, 0.125W; MANUFACTURER: Yaego; MFG: YAEGO; MPN: RC0402JR-0710KL
R26 R65 = GeneralLib:RESISTOR: Resistor; DESCRIPTION: Resistor, 1%, 0.125W; MANUFACTURER: Panasonic; MFG: PANASONIC; MPN: ERJ-2GEJ750X; MPN_DNI: ERJ-2GEJ750X
R45 = LooseLib1:RESISTOR; CROSS: YES; DESCRIPTION: Resistor, 5%, 0.1W; MFG: YAEGO; MPN: RC0402JR-071KL; POWER: 0.1W; PRODUCTION: YES; TOLERANCE: 5%
R51 = resistor:R-US_: RESISTOR, American symbol; MFG: Panasonic; MPN: ERJ-2GEJ104X; PKG: 0402
R70 = GeneralLib:RESISTOR: Resistor; DESCRIPTION: Resistor, 1%, 0.125W; MANUFACTURER: Panasonic; MFG: PANASONIC; MPN: DNI
R2000 = GeneralLib:RESISTOR: Resistor; DESCRIPTION: Resistor, 1%, 0.125W; MANUFACTURER: Yaego; MFG: YAEGO; MPN: RC0402JR-07470RL
RN1 = resistor-dil:4R-N: Array Chip Resistor Source: RS Component / Phycomp; MFG: BOURNES; MPN: CAY16-220J4LF; OC_FARNELL: unknown; OC_NEWARK: unknown; PACKAGE: CAY16; PARTNUM: CAY16-220J4LF
SIM1 = konekt:SIM_CARD_NANO; MFG: GLOBAL CONNECTOR TECHNOLOGY; MPN: SIM8050-6-0-14-01-A; PACKAGE: CUSTOM
SW1 SW3 SW4 = konekt:SWITCH_PANASONIC_EVP-BB2A1B000; MFG: PANASONIC; MPN: EVP-BB2A1B000; PACKAGE: EVP-BB
TP1 TP2 TP4-TP8 TP13 TP14 TP17 TP20-TP24 TP27 TP28 TP30 = testpad:TP: Test pad; MFG: N/A; MPN: N/A
U1 = konekt:ST_MICRO_BAT_CHARGER_L6924U013; MFG: ST Micro; MPN: L6924UTR; PACKAGE: VFQFPN16; PARTNUM: L6924UTR
U2 = konekt:TPS63021; MFG: TI; MPN: TPS63021DSJR; PACKAGE: QFN_14_3x4
U3 = konekt:MICROCHIP_FLASH_MEM; MFG: MICROCHIP; MPN: SST26VF016BT-104I/MF; PACKAGE: WDFN_5x6_MF
U4 = konekt:DIODE_DUAL_SCHOTKEY; MFG: FAIRCHILD; MPN: BAT54C; MPN_DNI: BAT54C; PACKAGE: SOT23
U5 = FreescaleMK20:MK20DX128VLH5: Teensy 3.0 Processing Unit - MK20DX128VLH5 ARM Cortex M0 Datasheet: http://cache.freescale.com/files/32bit/doc/data_sheet/K20P64M50SF0.pdf; MFG: Freescale; MPN: MK22FN1M0VLH12; PACKAGE: LQFP-64
U6 = konekt:FREESCALE_MKL17Z256VFM4; MFG: FREESCALE; MPN: MKL17Z256VFM4; PACKAGE: QFN32_5x5
U7 U9 = Konekt2:PESD12VL2BT,215; MFG: NXP; MPN: PESD12VL2BT,215; PACKAGE: SOT23; PARTNUM: PESD12VL2BT,215
U8 = konekt:VOLTAGE_TRANSLATOR_4_BIT; MFG: TI; MPN: SN74AVC4T774RSVR; PACKAGE: UQFN_16
U19 = MAX1704:MAX1704X: MAX17043/MAX17044: Battery Fuel Guage (43 is 1cell, 44 is 2cell); CROSS: NO; DESCRIPTION: Battery Fuel Gauge; MFG: Maxim; MPN: MAX17043G+U; PRODUCTION: YES
U420 = GeneralLib:SARA-U2XX; MFG: U-BLOX; MPN: SARA-U260-00S; PACKAGE: LGA-91; PARTNUMBER: SARA-U260
U$1 U$2 = konekt:TESTPAD
X1 = konekt:CERAMIC_RESONATOR_16MHZ_MURATA_CSTCE; MFG: MURATA; MPN: CSTCE16M0V53-R0; PACKAGE: CTSCE
X2 X3 = konekt:CRYSTAL_32.768K_AVX; MFG: AVX/ELCO/KYOCERA; MPN: ST3215SB32768E0HPWBB; PACKAGE: ST3215SB

## Net classes
1 power: width 0.406 mm, drill 0.61 mm, clearance 0.152 mm
2 gnd: width 0.203 mm, drill 0.203 mm, clearance 0.152 mm
3 usbvcc: width 0.203 mm, drill 0.61 mm, clearance 0.152 mm
4 aref: width 0.203 mm, drill 0.61 mm, clearance 0.152 mm
5 Vbatt: width 2.5 mm, drill 1 mm, clearance 0.125 mm
6 HIGH_SPEED: width 0.155 mm, drill 0.203 mm, clearance 0.152 mm
7 DIFF_HIGH_SPEED: width 0.157 mm, drill 0.203 mm, clearance 0.152 mm